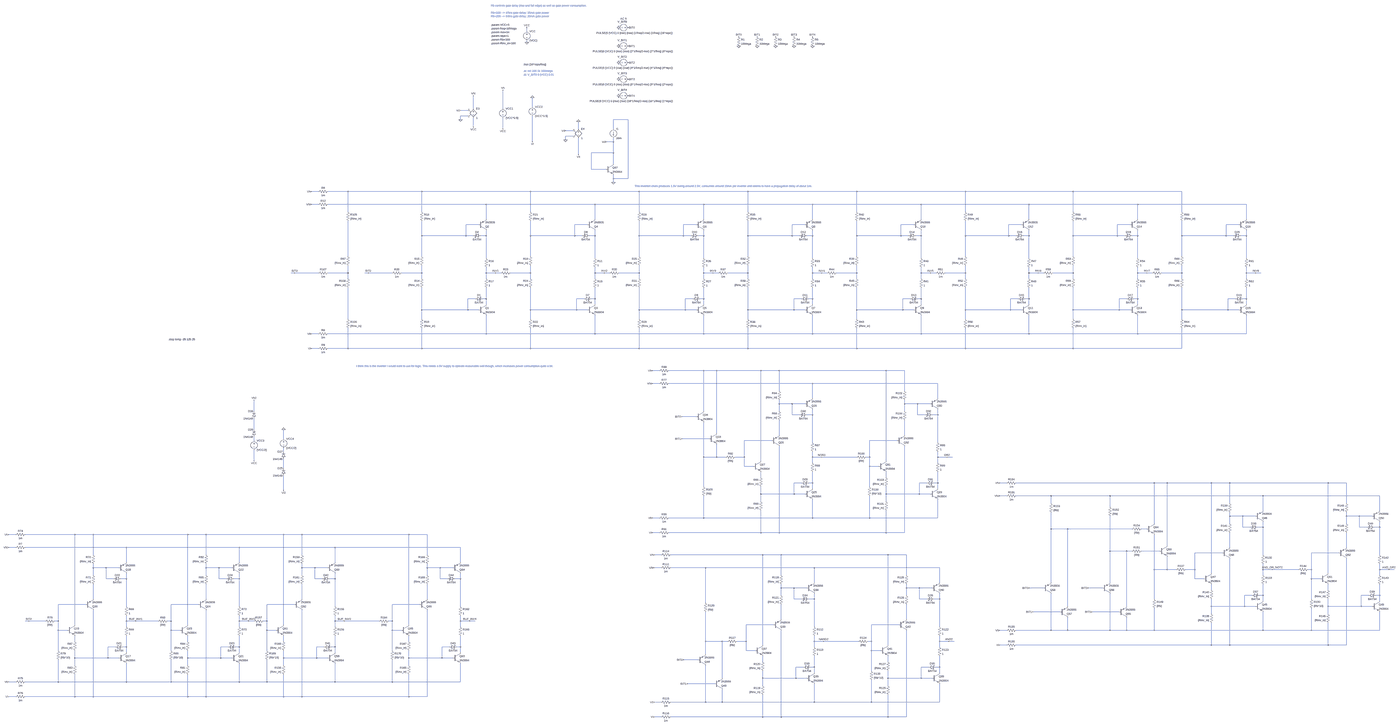
[diagram p0: schematic bitcell.asc, whole sheet]
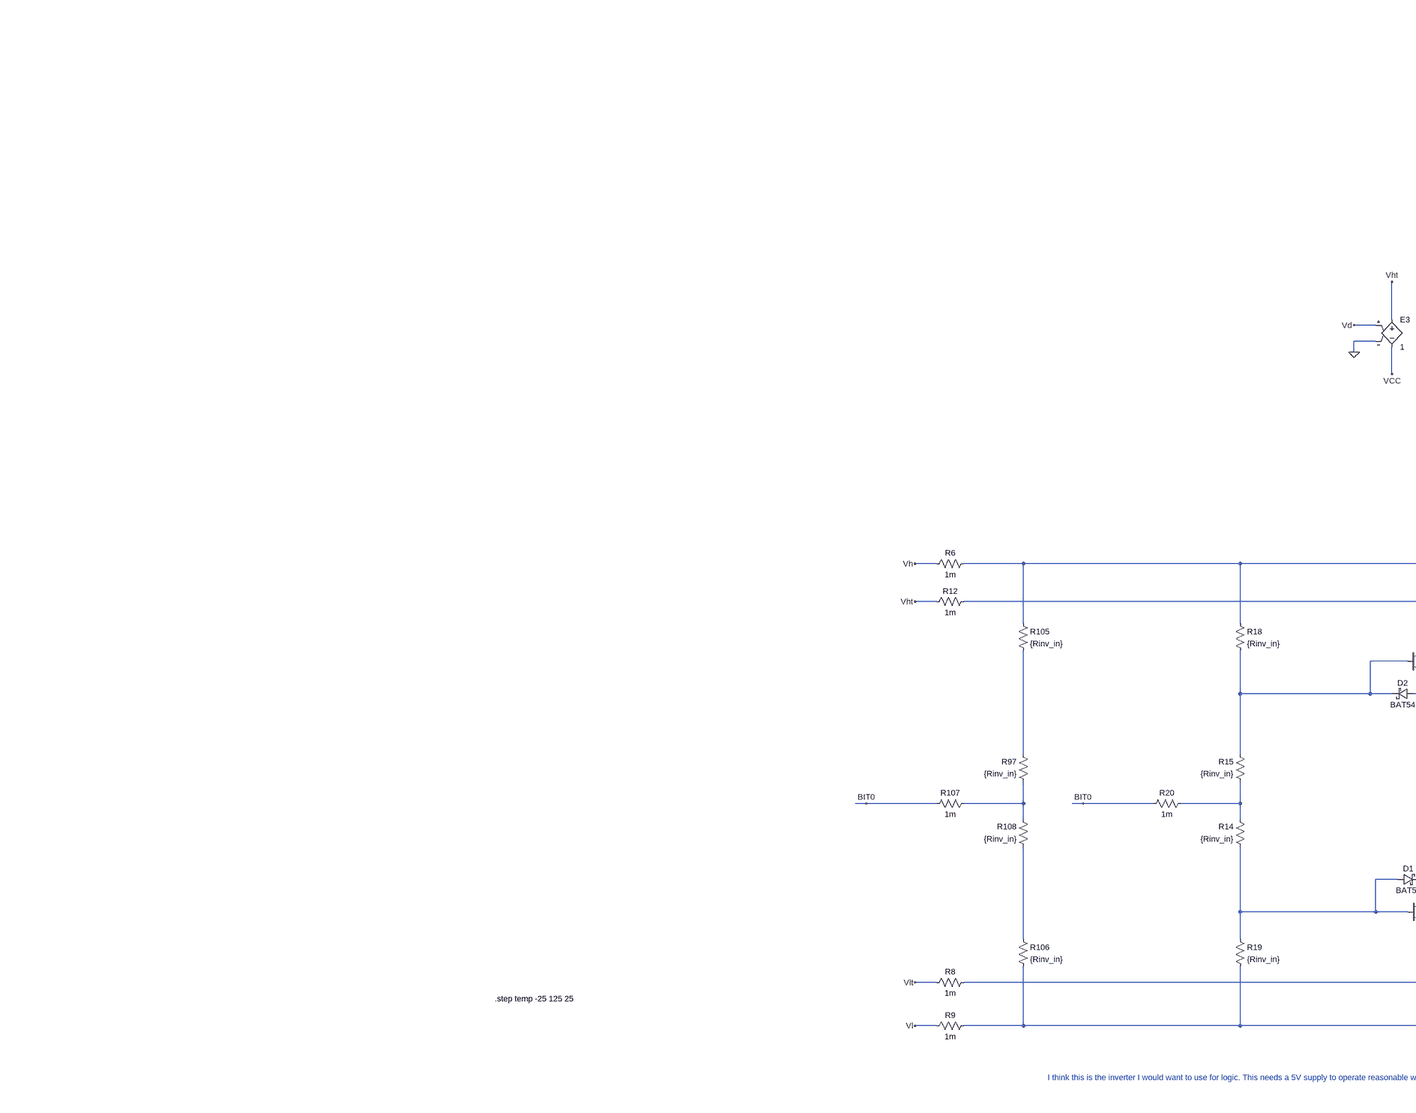
[diagram p1: schematic bitcell.asc, part, row 1 of 2, column 1 of 3]
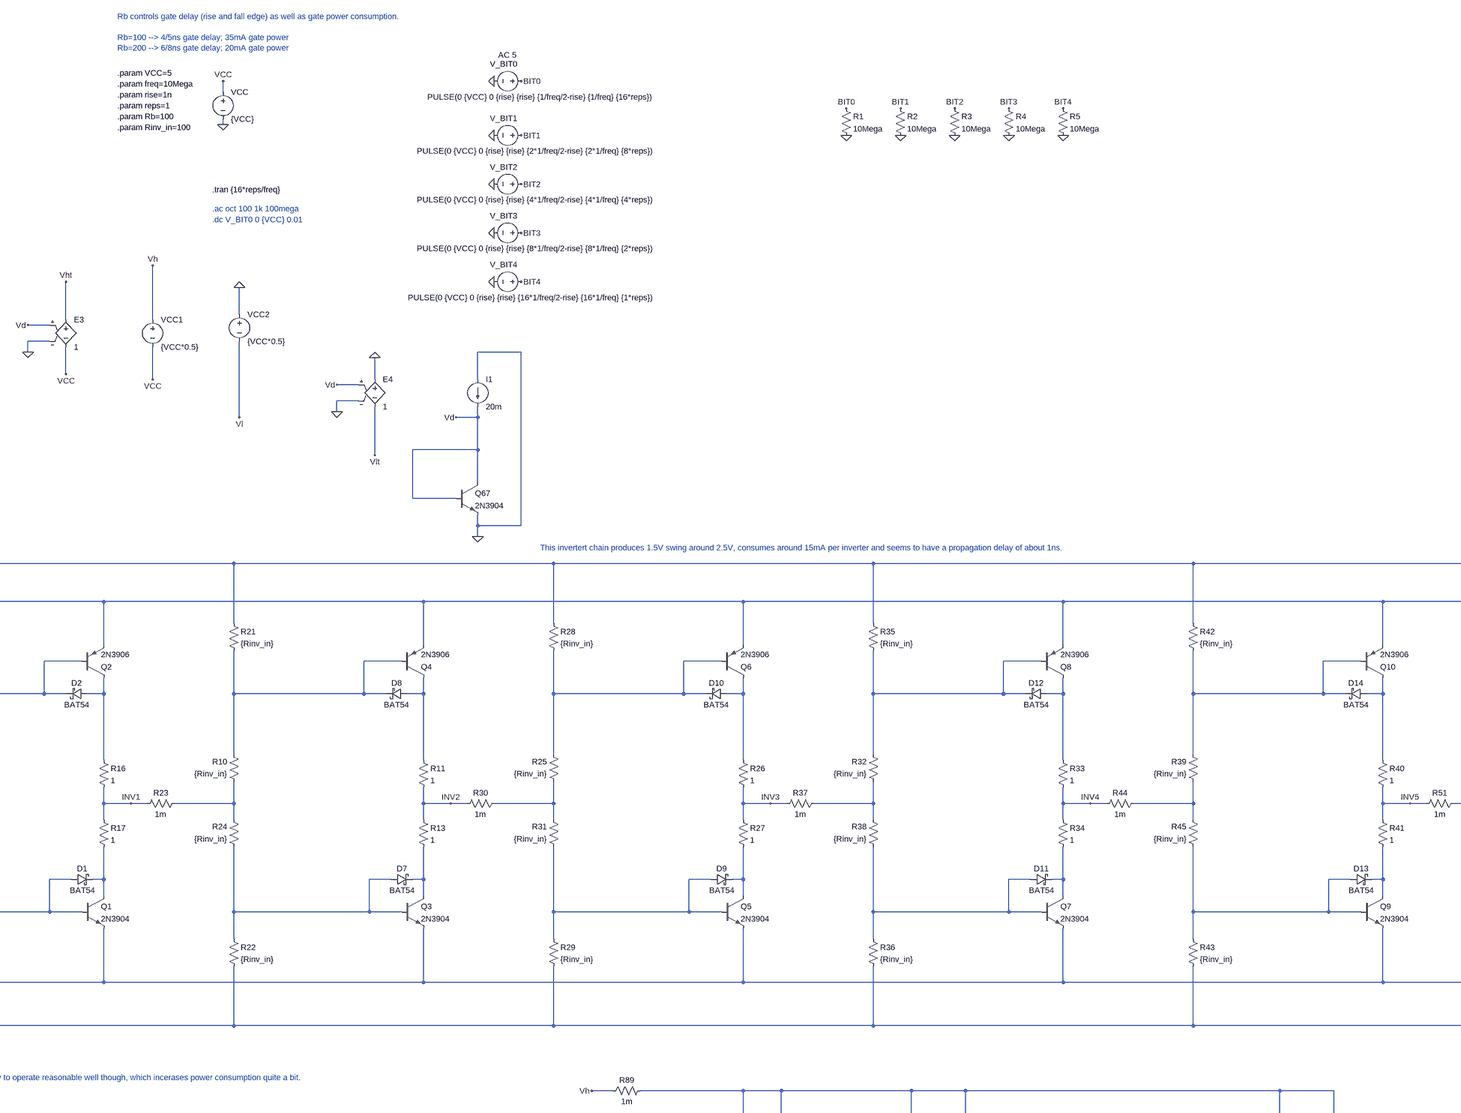
[diagram p2: schematic bitcell.asc, part, row 1 of 2, column 2 of 3]
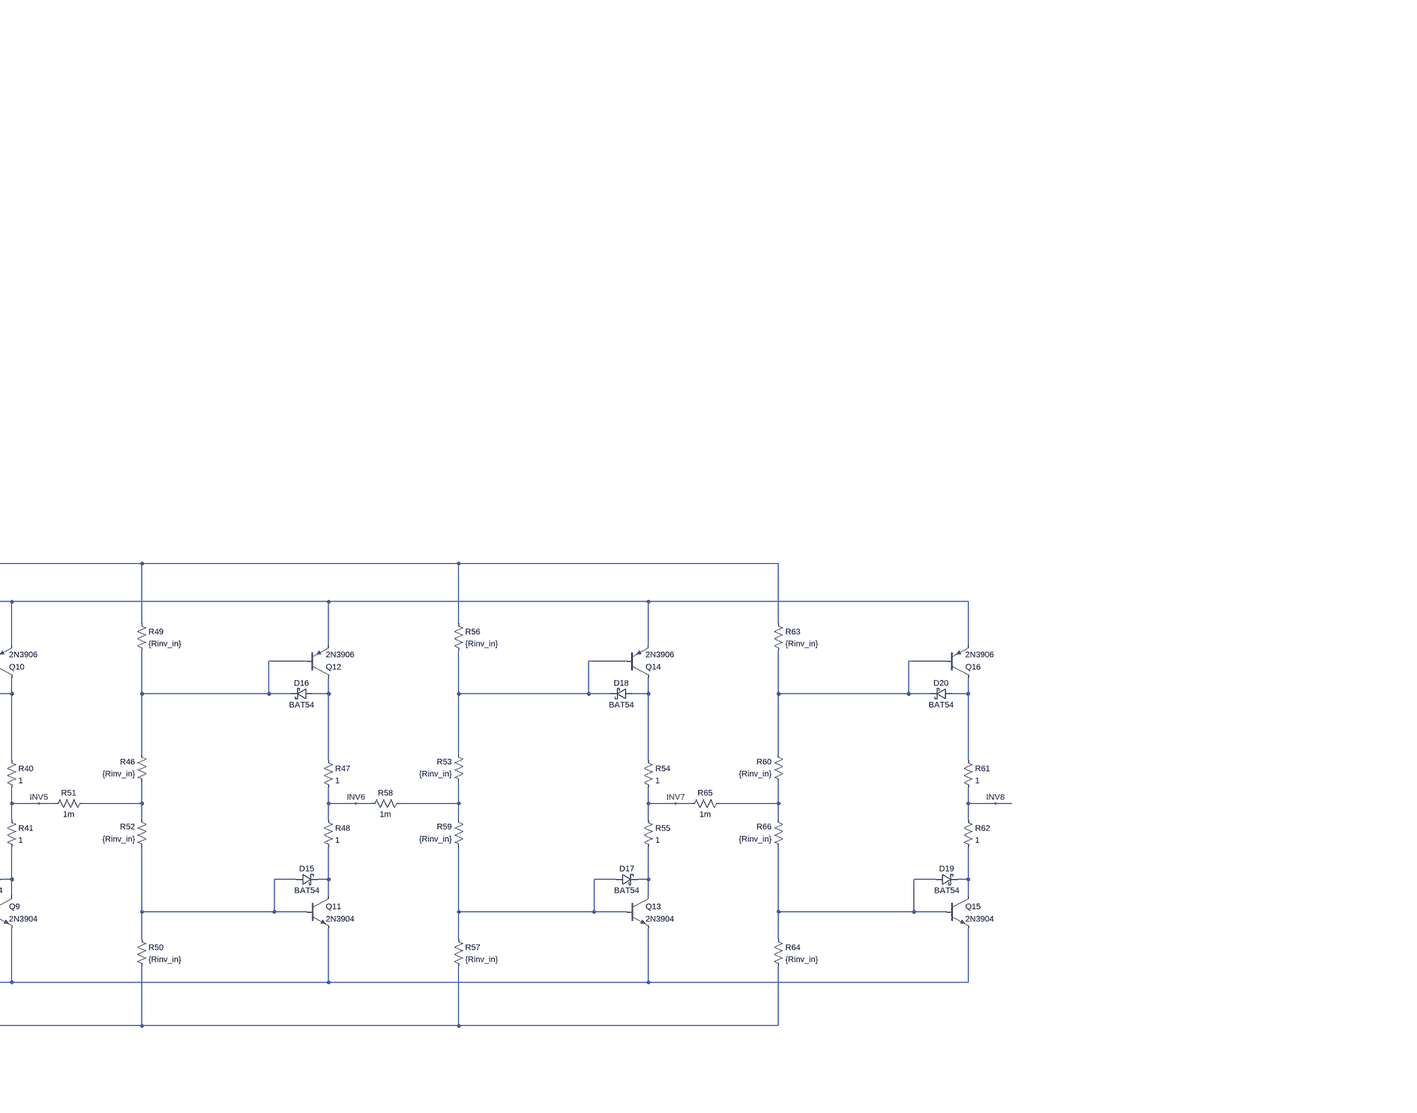
[diagram p3: schematic bitcell.asc, part, row 1 of 2, column 3 of 3]
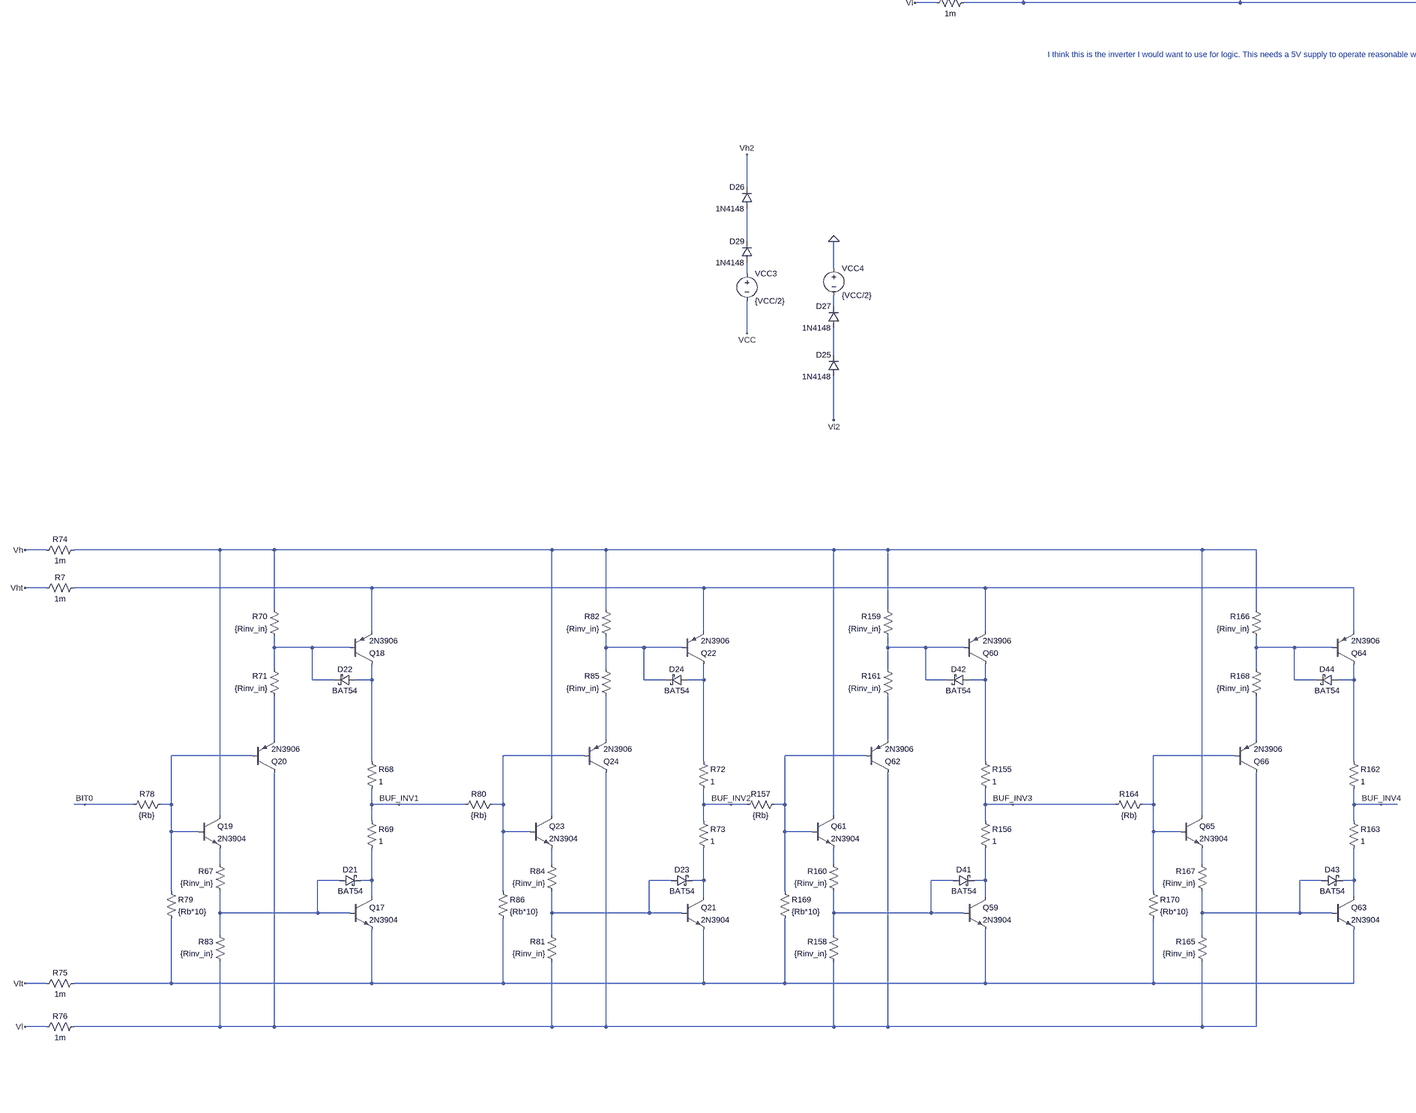
[diagram p4: schematic bitcell.asc, part, row 2 of 2, column 1 of 3]
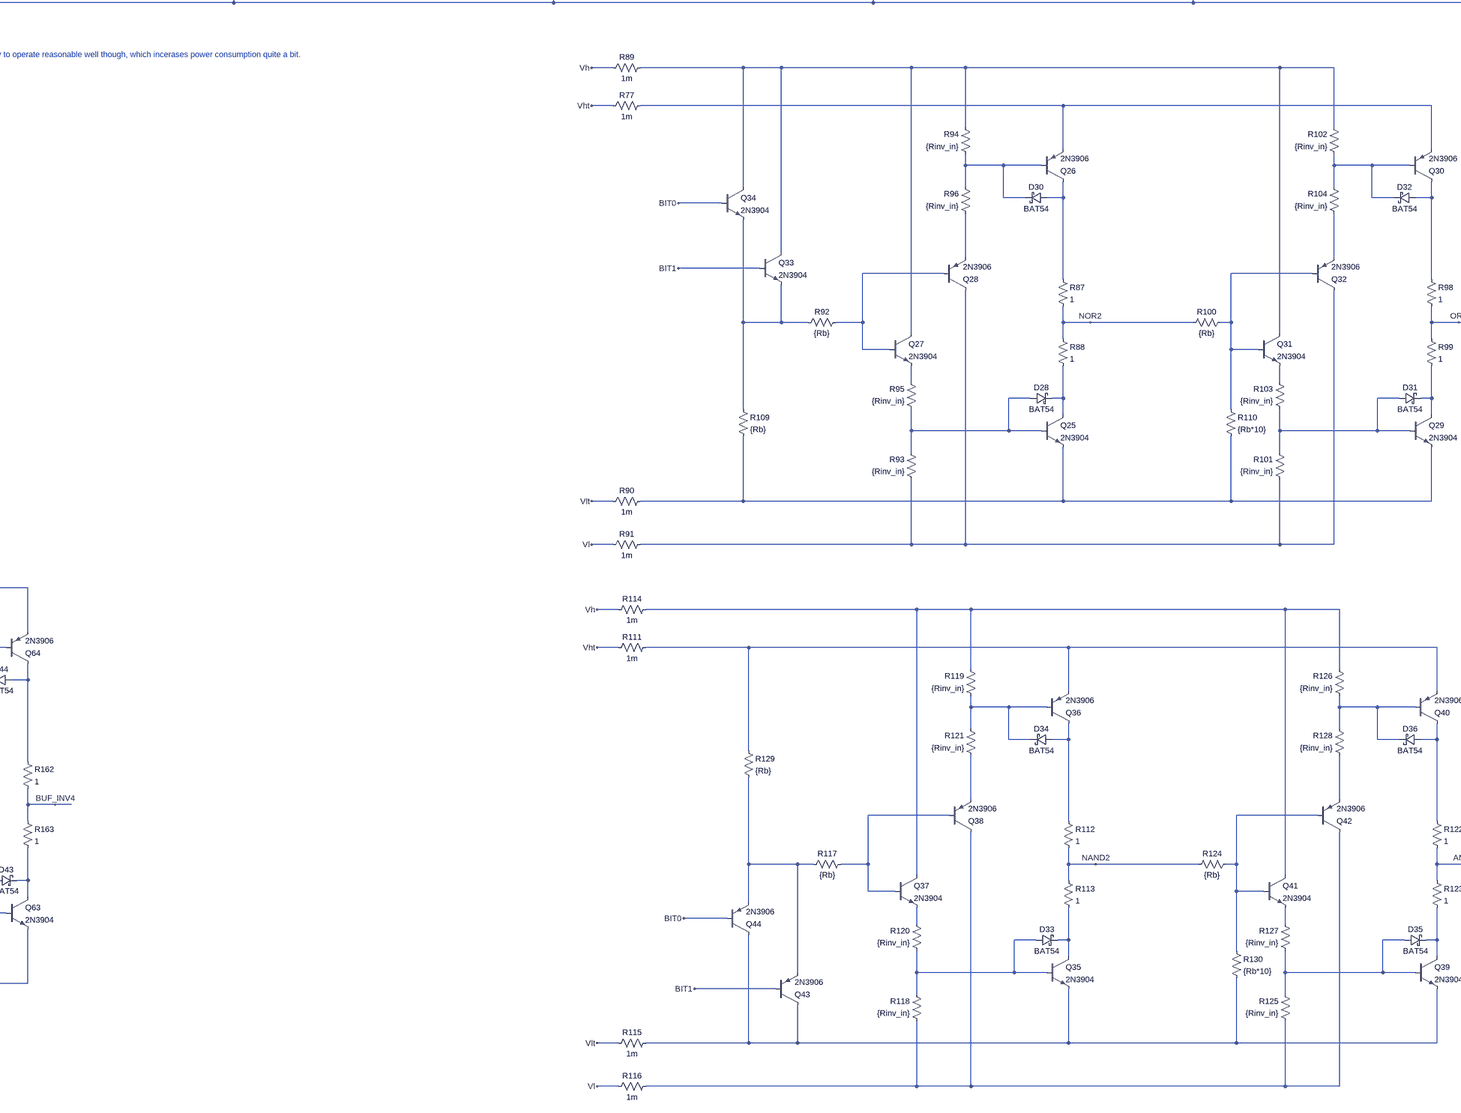
[diagram p5: schematic bitcell.asc, part, row 2 of 2, column 2 of 3]
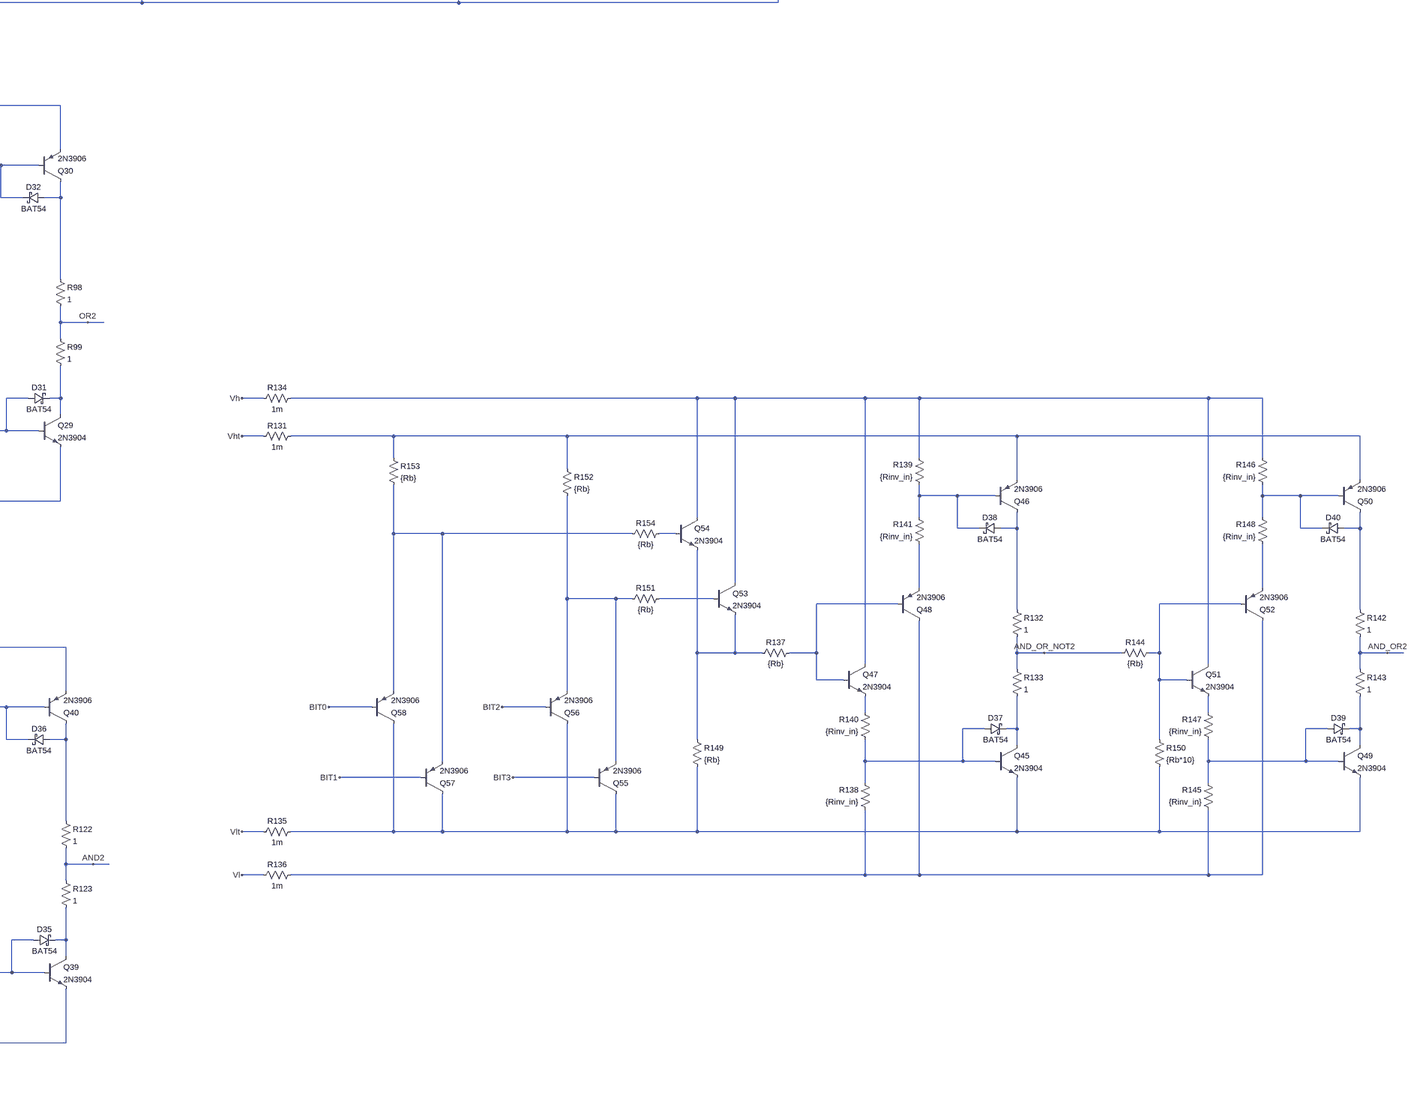
[diagram p6: schematic bitcell.asc, part, row 2 of 2, column 3 of 3]
* bitcell.asc
VCC VCC 0 {VCC}
V_BIT0 BIT0 0 PULSE(0 {VCC} 0 {rise} {rise} {1/freq/2-rise} {1/freq} {16*reps}) AC 5
V_BIT1 BIT1 0 PULSE(0 {VCC} 0 {rise} {rise} {2*1/freq/2-rise} {2*1/freq} {8*reps})
V_BIT2 BIT2 0 PULSE(0 {VCC} 0 {rise} {rise} {4*1/freq/2-rise} {4*1/freq} {4*reps})
V_BIT3 BIT3 0 PULSE(0 {VCC} 0 {rise} {rise} {8*1/freq/2-rise} {8*1/freq} {2*reps})
V_BIT4 BIT4 0 PULSE(0 {VCC} 0 {rise} {rise} {16*1/freq/2-rise} {16*1/freq} {1*reps})
R1 BIT0 0 10Mega
R2 BIT1 0 10Mega
R3 BIT2 0 10Mega
R4 BIT3 0 10Mega
R5 BIT4 0 10Mega
Q1 N030 N029 N046 0 2N3904
D1 N029 N030 BAT54
R12 Vht N002 1m
Q2 N011 N003 N002 0 2N3906
D2 N011 N003 BAT54
R15 N021 N003 {Rinv_in}
R16 N011 INV1 1
R17 INV1 N030 1
R18 N001 N003 {Rinv_in}
R19 N029 N047 {Rinv_in}
R20 N021 BIT0 1m
R14 N029 N021 {Rinv_in}
VCC1 Vh VCC {VCC*0.5}
VCC2 0 Vl {VCC*0.5}
R6 Vh N001 1m
R8 Vlt N046 1m
R9 Vl N047 1m
Q3 N032 N031 N046 0 2N3904
D7 N031 N032 BAT54
Q4 N012 N004 N002 0 2N3906
D8 N012 N004 BAT54
R10 N022 N004 {Rinv_in}
R11 N012 INV2 1
R13 INV2 N032 1
R21 N001 N004 {Rinv_in}
R22 N031 N047 {Rinv_in}
R23 N022 INV1 1m
R24 N031 N022 {Rinv_in}
Q5 N034 N033 N046 0 2N3904
D9 N033 N034 BAT54
Q6 N013 N005 N002 0 2N3906
D10 N013 N005 BAT54
R25 N023 N005 {Rinv_in}
R26 N013 INV3 1
R27 INV3 N034 1
R28 N001 N005 {Rinv_in}
R29 N033 N047 {Rinv_in}
R30 N023 INV2 1m
R31 N033 N023 {Rinv_in}
Q7 N036 N035 N046 0 2N3904
D11 N035 N036 BAT54
Q8 N014 N006 N002 0 2N3906
D12 N014 N006 BAT54
R32 N024 N006 {Rinv_in}
R33 N014 INV4 1
R34 INV4 N036 1
R35 N001 N006 {Rinv_in}
R36 N035 N047 {Rinv_in}
R37 N024 INV3 1m
R38 N035 N024 {Rinv_in}
Q9 N038 N037 N046 0 2N3904
D13 N037 N038 BAT54
Q10 N015 N007 N002 0 2N3906
D14 N015 N007 BAT54
R39 N025 N007 {Rinv_in}
R40 N015 INV5 1
R41 INV5 N038 1
R42 N001 N007 {Rinv_in}
R43 N037 N047 {Rinv_in}
R44 N025 INV4 1m
R45 N037 N025 {Rinv_in}
Q11 N040 N039 N046 0 2N3904
D15 N039 N040 BAT54
Q12 N016 N008 N002 0 2N3906
D16 N016 N008 BAT54
R46 N026 N008 {Rinv_in}
R47 N016 INV6 1
R48 INV6 N040 1
R49 N001 N008 {Rinv_in}
R50 N039 N047 {Rinv_in}
R51 N026 INV5 1m
R52 N039 N026 {Rinv_in}
Q13 N042 N041 N046 0 2N3904
D17 N041 N042 BAT54
Q14 N017 N009 N002 0 2N3906
D18 N017 N009 BAT54
R53 N027 N009 {Rinv_in}
R54 N017 INV7 1
R55 INV7 N042 1
R56 N001 N009 {Rinv_in}
R57 N041 N047 {Rinv_in}
R58 N027 INV6 1m
R59 N041 N027 {Rinv_in}
Q15 N044 N043 N046 0 2N3904
D19 N043 N044 BAT54
Q16 N018 N010 N002 0 2N3906
D20 N018 N010 BAT54
R60 N028 N010 {Rinv_in}
R61 N018 INV8 1
R62 INV8 N044 1
R63 N001 N010 {Rinv_in}
R64 N043 N047 {Rinv_in}
R65 N028 INV7 1m
R66 N043 N028 {Rinv_in}
Q17 N128 N127 N141 0 2N3904
D21 N127 N128 BAT54
Q18 N094 N088 N080 0 2N3906
D22 N094 N088 BAT54
R68 N094 BUF_INV1 1
R69 BUF_INV1 N128 1
R78 N112 BIT0 {Rb}
VCC3 N057 VCC {VCC/2}
VCC4 0 N060 {VCC/2}
D27 N062 N060 1N4148
D29 N057 N054 1N4148
R97 N020 N019 {Rinv_in}
R105 N001 N019 {Rinv_in}
R106 N045 N047 {Rinv_in}
R107 N020 BIT0 1m
R108 N045 N020 {Rinv_in}
R83 N142 N127 {Rinv_in}
Q19 N079 N112 N121 0 2N3904
R70 N088 N079 {Rinv_in}
Q20 N142 N112 N106 0 2N3906
R67 N127 N121 {Rinv_in}
R71 N106 N088 {Rinv_in}
Q21 N130 N129 N141 0 2N3904
D23 N129 N130 BAT54
Q22 N095 N089 N080 0 2N3906
D24 N095 N089 BAT54
R72 N095 BUF_INV2 1
R73 BUF_INV2 N130 1
R80 N113 BUF_INV1 {Rb}
R81 N142 N129 {Rinv_in}
Q23 N079 N113 N122 0 2N3904
R82 N089 N079 {Rinv_in}
Q24 N142 N113 N107 0 2N3906
R84 N129 N122 {Rinv_in}
R85 N107 N089 {Rinv_in}
D25 Vl2 N062 1N4148
D26 N054 Vh2 1N4148
R79 N112 N141 {Rb*10}
R86 N113 N141 {Rb*10}
Q25 N066 N065 N073 0 2N3904
D28 N065 N066 BAT54
Q26 N052 N050 N049 0 2N3906
D30 N052 N050 BAT54
R87 N052 NOR2 1
R88 NOR2 N066 1
R92 N061 N058 {Rb}
R93 N078 N065 {Rinv_in}
Q27 N048 N058 N063 0 2N3904
R94 N050 N048 {Rinv_in}
Q28 N078 N058 N055 0 2N3906
R95 N065 N063 {Rinv_in}
R96 N055 N050 {Rinv_in}
Q29 N068 N067 N073 0 2N3904
D31 N067 N068 BAT54
Q30 N053 N051 N049 0 2N3906
D32 N053 N051 BAT54
R98 N053 OR2 1
R99 OR2 N068 1
R100 N059 NOR2 {Rb}
R101 N078 N067 {Rinv_in}
Q31 N048 N059 N064 0 2N3904
R102 N051 N048 {Rinv_in}
Q32 N078 N059 N056 0 2N3906
R103 N067 N064 {Rinv_in}
R104 N056 N051 {Rinv_in}
R109 N061 N073 {Rb}
R110 N059 N073 {Rb*10}
Q33 N048 BIT1 N061 0 2N3904
Q34 N048 BIT0 N061 0 2N3904
Q35 N138 N137 N143 0 2N3904
D33 N137 N138 BAT54
Q36 N110 N098 N092 0 2N3906
D34 N110 N098 BAT54
R112 N110 NAND2 1
R113 NAND2 N138 1
R117 N125 N118 {Rb}
R118 N144 N137 {Rinv_in}
Q37 N087 N118 N135 0 2N3904
R119 N098 N087 {Rinv_in}
Q38 N144 N118 N116 0 2N3906
R120 N137 N135 {Rinv_in}
R121 N116 N098 {Rinv_in}
Q39 N140 N139 N143 0 2N3904
D35 N139 N140 BAT54
Q40 N111 N099 N092 0 2N3906
D36 N111 N099 BAT54
R122 N111 AND2 1
R123 AND2 N140 1
R124 N119 NAND2 {Rb}
R125 N144 N139 {Rinv_in}
Q41 N087 N119 N136 0 2N3904
R126 N099 N087 {Rinv_in}
Q42 N144 N119 N117 0 2N3906
R127 N139 N136 {Rinv_in}
R128 N117 N099 {Rinv_in}
R129 N092 N125 {Rb}
R130 N119 N143 {Rb*10}
Q43 N143 BIT1 N125 0 2N3906
Q44 N143 BIT0 N125 0 2N3906
Q45 N103 N102 N120 0 2N3904
D37 N102 N103 BAT54
Q46 N074 N071 N070 0 2N3906
D38 N074 N071 BAT54
R132 N074 AND_OR_NOT2 1
R133 AND_OR_NOT2 N103 1
R137 N093 N085 {Rb}
R138 N126 N102 {Rinv_in}
Q47 N069 N085 N100 0 2N3904
R139 N071 N069 {Rinv_in}
Q48 N126 N085 N081 0 2N3906
R140 N102 N100 {Rinv_in}
R141 N081 N071 {Rinv_in}
Q49 N105 N104 N120 0 2N3904
D39 N104 N105 BAT54
Q50 N075 N072 N070 0 2N3906
D40 N075 N072 BAT54
R142 N075 AND_OR2 1
R143 AND_OR2 N105 1
R144 N086 AND_OR_NOT2 {Rb}
R145 N126 N104 {Rinv_in}
Q51 N069 N086 N101 0 2N3904
R146 N072 N069 {Rinv_in}
Q52 N126 N086 N082 0 2N3906
R147 N104 N101 {Rinv_in}
R148 N082 N072 {Rinv_in}
R149 N093 N120 {Rb}
R150 N086 N120 {Rb*10}
Q53 N069 N084 N093 0 2N3904
Q54 N069 N077 N093 0 2N3904
R151 N083 N084 {Rb}
R152 N070 N083 {Rb}
Q55 N120 BIT3 N083 0 2N3906
Q56 N120 BIT2 N083 0 2N3906
R153 N070 N076 {Rb}
Q57 N120 BIT1 N076 0 2N3906
Q58 N120 BIT0 N076 0 2N3906
R154 N076 N077 {Rb}
Q59 N132 N131 N141 0 2N3904
D41 N131 N132 BAT54
Q60 N096 N090 N080 0 2N3906
D42 N096 N090 BAT54
R155 N096 BUF_INV3 1
R156 BUF_INV3 N132 1
R157 N114 BUF_INV2 {Rb}
R158 N142 N131 {Rinv_in}
Q61 N079 N114 N123 0 2N3904
R159 N090 N079 {Rinv_in}
Q62 N142 N114 N108 0 2N3906
R160 N131 N123 {Rinv_in}
R161 N108 N090 {Rinv_in}
Q63 N134 N133 N141 0 2N3904
D43 N133 N134 BAT54
Q64 N097 N091 N080 0 2N3906
D44 N097 N091 BAT54
R162 N097 BUF_INV4 1
R163 BUF_INV4 N134 1
R164 N115 BUF_INV3 {Rb}
R165 N142 N133 {Rinv_in}
Q65 N079 N115 N124 0 2N3904
R166 N091 N079 {Rinv_in}
Q66 N142 N115 N109 0 2N3906
R167 N133 N124 {Rinv_in}
R168 N109 N091 {Rinv_in}
R169 N114 N141 {Rb*10}
R170 N115 N141 {Rb*10}
I1 0 Vd 20m
E3 Vht VCC Vd 0 1
E4 0 Vlt Vd 0 1
Q67 Vd Vd 0 0 2N3904
R7 Vht N080 1m
R74 Vh N079 1m
R75 Vlt N141 1m
R76 Vl N142 1m
R77 Vht N049 1m
R89 Vh N048 1m
R90 Vlt N073 1m
R91 Vl N078 1m
R111 Vht N092 1m
R114 Vh N087 1m
R115 Vlt N143 1m
R116 Vl N144 1m
R131 Vht N070 1m
R134 Vh N069 1m
R135 Vlt N120 1m
R136 Vl N126 1m
.model D D
.lib standard.dio
.model NPN NPN
.model PNP PNP
.lib standard.bjt
.tran {16*reps/freq}
* .ac oct 100 1k 100mega
* .dc V_BIT0 0 {VCC} 0.01
.param VCC=5
.param freq=10Mega
.param rise=1n
.param reps=1
.param Rb=100
* Rb controls gate delay (rise and fall edge) as well as gate power consumption.
* Rb=100 --> 4/5ns gate delay; 35mA gate power
* Rb=200 --> 6/8ns gate delay; 20mA gate power
* This invertert chain produces 1.5V swing around 2.5V, consumes around 15mA per inverter and seems to have a propagation delay of about 1ns.
.param Rinv_in=100
.step temp -25 125 25
* I think this is the inverter I would want to use for logic. This needs a 5V supply to operate reasonable well though, which incerases power consumption quite a bit.
.backanno
.end